# EAGLE design Seeeduino v3.0 (EAGLE 6.4)
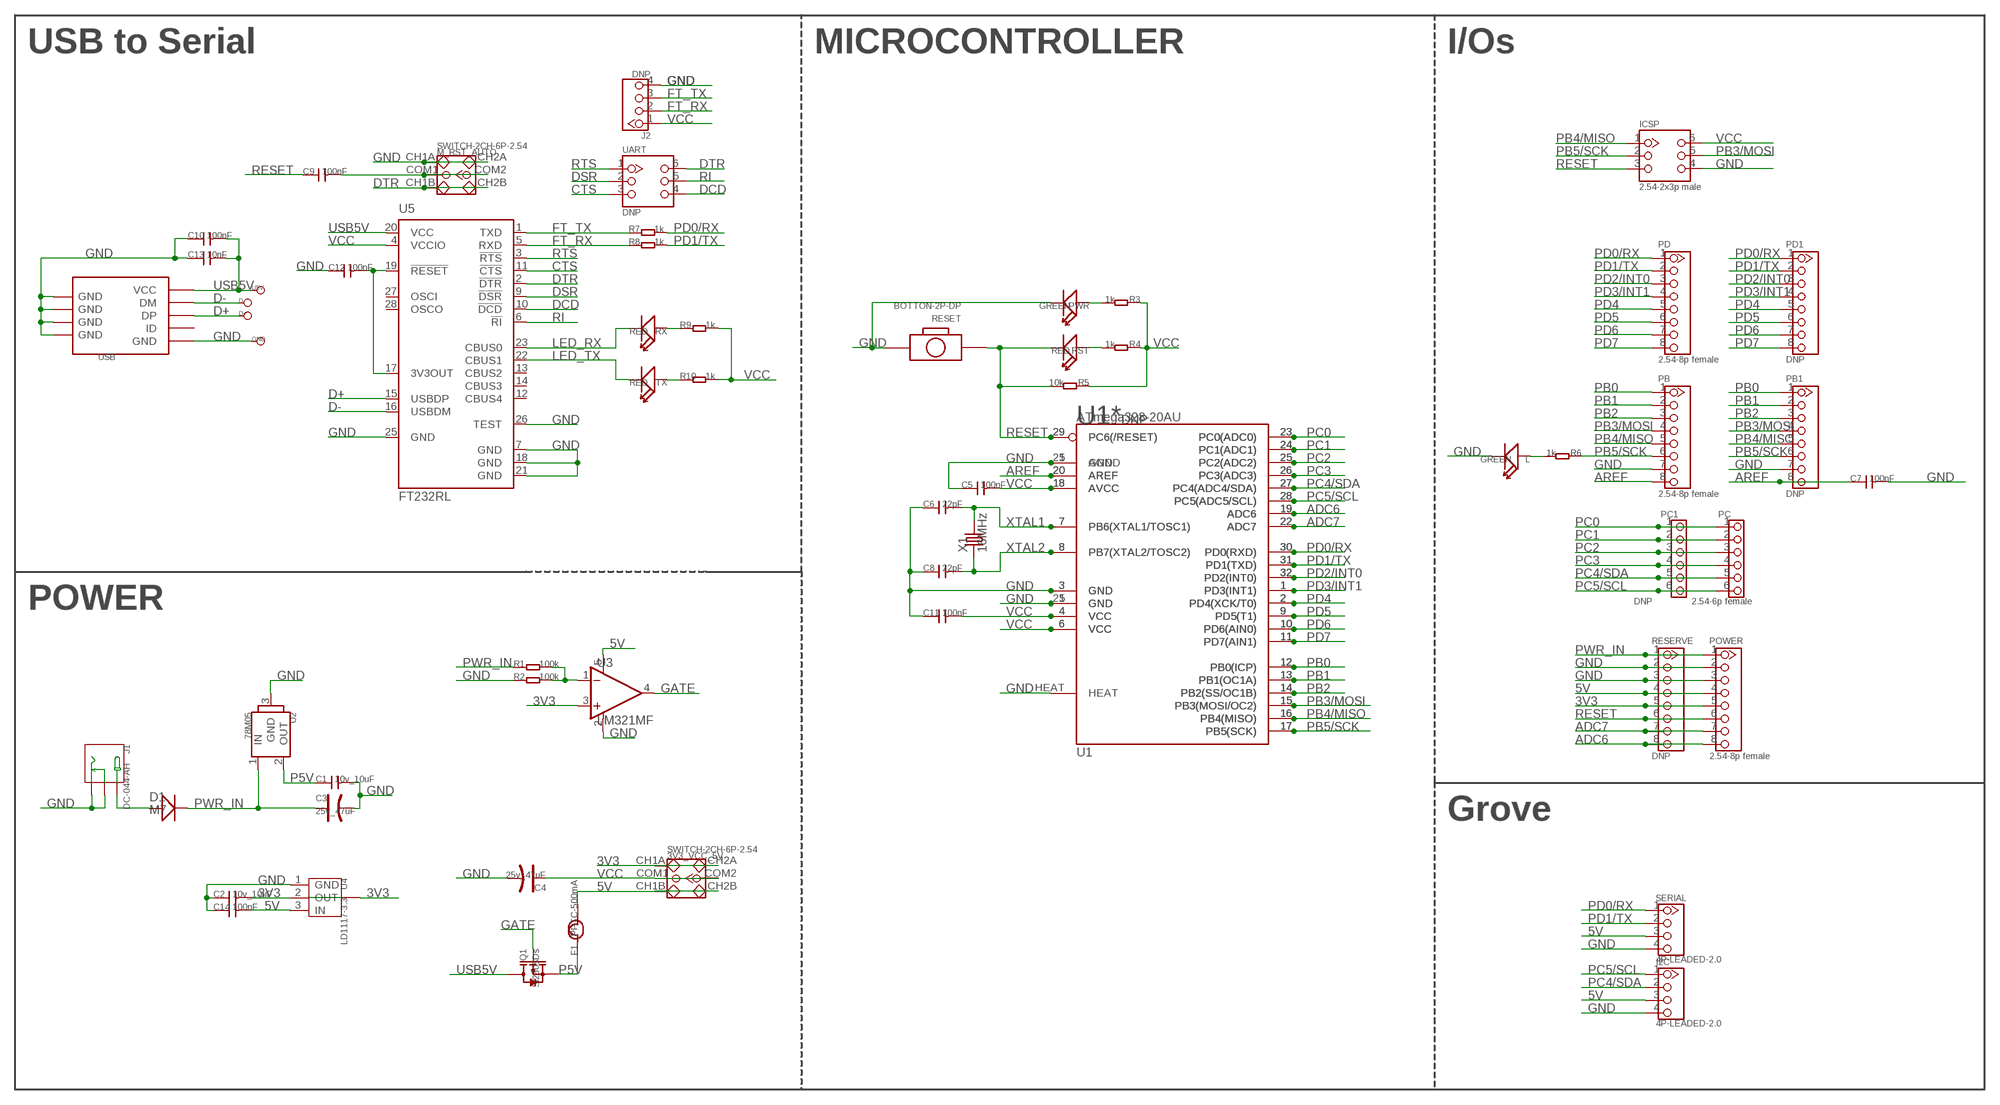
[diagram p0: schematic, sheet 1]

## Parts
3V3_VCC_5V  SWITCH-2CH-6P-2.54  SWITCH-2CH-6P  [6P-2CH-2.54-7.6X3.0]
C1  10v_10uF  C-0805  [0805]
C2  10v_10uF  C-0805  [0805]
C3  25v_47uF  CAP-ELECTRO-C  [ELECTRO-SMD-C-6MM]
C4  25v_47uF  CAP-ELECTRO-C  [ELECTRO-SMD-C-6MM]
C5  100nF  C-0603  [0603]
C6  22pF  C-0603  [0603]
C7  100nF  C-0603  [0603]
C8  22pF  C-0603  [0603]
C9  100nF  C-0603  [0603]
C10  100nF  C-0603  [0603]
C11  100nF  C-0603  [0603]
C12  100nF  C-0603  [0603]
C13  10nF  C-0603  [0603]
C14  100nF  C-0603  [0603]
D1  M7  D-SMA  [D2010]
D+  TEST_POINT_SIZE_3030  [TP_3535]
D-  TEST_POINT_SIZE_3030  [TP_3535]
F1  PPTC-500mA  FUSE  [1206]
GND  TEST_POINT_SIZE_3030  [TP_3535]
I2C  4P-LEADED-2.0  TWIG-2.0-LEADED  [4P-LEADED-2.0]
ICSP  2.54-2x3p male  HEADER-2X3P-2.54  [2X3P-2.54]
J1  DC-044-AH  DC-044  [DC-404]
J2  DNP  CK_1X4_DD  [CK_1X4]
L  GREEN  LED'0603'  [LED-0603]
M_RST_AUTO  SWITCH-2CH-6P-2.54  SWITCH-2CH-6P  [6P-2CH-2.54-7.6X3.0]
PB  2.54-8p female  HEADER-8P-2.54  [8P-2.54]
PB1  DNP  HEADER-8P-2.54  [8P-2.54]
PC  2.54-6p female  HEADER-6P-65/35MIL  [6P-2.54-65/35MIL]
PC1  DNP  HEADER-6P-65/35MIL  [6P-2.54-65/35MIL]
PD  2.54-8p female  HEADER-8P-2.54  [8P-2.54]
PD1  DNP  HEADER-8P-2.54  [8P-2.54]
POWER  2.54-8p female  HEADER-8P-2.54  [8P-2.54]
PWR  GREEN  LED'0603'  [LED-0603]
Q1  Si2305Ds  MOSFET-P-SOT23  [SOT23]
R1  100k  R-0603  [0603]
R2  100k  R-0603  [0603]
R3  1k  R-0603  [0603]
R4  1k  R-0603  [0603]
R5  10k  R-0603  [0603]
R6  1k  R-0603  [0603]
R7  1k  R-0603  [0603]
R8  1k  R-0603  [0603]
R9  1k  R-0603  [0603]
R10  1k  R-0603  [0603]
RESERVE  DNP  HEADER-8P-2.54  [8P-2.54]
RESET  BOTTON-2P-DP  BOTTON-2P-90  [2P-7.62X3.56-90D]
RST  RED  LED'0603'  [LED-0603]
RX  RED  LED'0603'  [LED-0603]
SERIAL  4P-LEADED-2.0  TWIG-2.0-LEADED  [4P-LEADED-2.0]
TX  RED  LED'0603'  [LED-0603]
U1  ATmega328-20AU  ATMEGA168  [TQFP32]
U1*  DNP  MEGA8  [MLF32X]
U2  78M05  78M05-TO252  [TO252]
U3  LM321MF  LM321  [SOT23-5]
U4  LD1117-3.3  LD1117SOT89  [SOT89]
U5  FT232RL  [SSOP28]
U5V  TEST_POINT_SIZE_3030  [TP_3535]
UART  DNP  HEADER-2X3P-2.54  [2X3P-2.54]
USB  USB-MINIUSB-5P-STRONG  [MINI-SMD-5P]
X1  16MHz  CRYSTAL-HC49S  [HC49/S]

## Nets
3V3: 3V3_VCC_5V.CH1A 3V3_VCC_5V.CH2A C2.2 POWER.5 RESERVE.5 U3.3(IN+) U4.2(OUT) U4.4(TAB)
5V [usbvcc]: 3V3_VCC_5V.CH1B 3V3_VCC_5V.CH2B C14.2 F1.2 I2C.3 POWER.4 RESERVE.4 SERIAL.3 U3.5(V+) U4.3(IN)
ADC6: POWER.8 RESERVE.8 U1*.19(ADC6) U1.19(ADC6)
ADC7: POWER.7 RESERVE.7 U1*.22(ADC7) U1.22(ADC7)
AREF: C7.1 PB1.8 PB.8 U1*.20(AREF) U1.20(AREF)
CTS: U5.11(!CTS) UART.3
D+: D+.T U5.15(USBDP) USB.3(DP)
D-: D-.T U5.16(USBDM) USB.2(DM)
DCD: U5.10(!DCD) UART.4
DSR: U5.9(!DSR) UART.2
DTR: M_RST_AUTO.CH1B M_RST_AUTO.CH2B U5.2(!DTR) UART.6
FT_RX: J2.2 R8.1 U5.5(RXD)
FT_TX: J2.3 R7.1 U5.1(TXD)
GATE: Q1.1(G) U3.4(OUT)
GND: C1.2 C2.1 C3.- C4.- C5.1 C6.1 C7.2 C8.1 C10.1 C11.1 C12.1 C13.1 C14.1 GND.T I2C.4 ICSP.4 J1.- J1.CDN J2.4 L.- M_RST_AUTO.CH1A M_RST_AUTO.CH2A PB1.7 PB.7 POWER.2 POWER.3 PWR.- R2.1 RESERVE.2 RESERVE.3 RESET.P$2 SERIAL.4 U1*.3(GND) U1*.5(GND) U1*.21(AGND) U1*.HEAT U1.3(GND) U1.5(GND) U1.21(GND) U2.3(GND) U3.2(V-) U4.1(GND) U5.7(GND) U5.18(GND) U5.21(GND) U5.25(GND) U5.26(TEST) USB.5(GND) USB.GND@1(GND) USB.GND@2(GND) USB.GND@3(GND) USB.GND@4(GND)
LED_RX: RX.- U5.23(CBUS0)
LED_TX: TX.- U5.22(CBUS1)
N$1: D1.+ J1.+
N$3: L.+ R6.2
N$6: C12.2 U5.17(3V3OUT) U5.19(!RESET)
N$7: PWR.+ R3.2
N$14: R1.2 R2.2 U3.1(IN-)
N$17: R4.2 RST.+
N$18: C9.2 M_RST_AUTO.COM1 M_RST_AUTO.COM2
N$31: R9.1 RX.+
N$32: R10.1 TX.+
P5V: C1.1 F1.1 Q1.2(S) U2.2(OUT)
PB0: PB1.1 PB.1 U1*.12(PB0(ICP)) U1.12(PB0(ICP))
PB1: PB1.2 PB.2 U1*.13(PB1(OC1A)) U1.13(PB1(OC1A))
PB2: PB1.3 PB.3 U1*.14(PB2(SS/OC1B)) U1.14(PB2(SS/OC1B))
PB3/MOSI: ICSP.5 PB1.4 PB.4 U1*.15(PB3(MOSI/OC2)) U1.15(PB3(MOSI/OC2))
PB4/MISO: ICSP.1 PB1.5 PB.5 U1*.16(PB4(MISO)) U1.16(PB4(MISO))
PB5/SCK: ICSP.2 PB1.6 PB.6 R6.1 U1*.17(PB5(SCK)) U1.17(PB5(SCK))
PC0: PC1.1 PC.1 U1*.23(PC0(ADC0)) U1.23(PC0(ADC0))
PC1: PC1.2 PC.2 U1*.24(PC1(ADC1)) U1.24(PC1(ADC1))
PC2: PC1.3 PC.3 U1*.25(PC2(ADC2)) U1.25(PC2(ADC2))
PC3: PC1.4 PC.4 U1*.26(PC3(ADC3)) U1.26(PC3(ADC3))
PC4/SDA: I2C.2 PC1.5 PC.5 U1*.27(PC4(ADC4/SDA)) U1.27(PC4(ADC4/SDA))
PC5/SCL: I2C.1 PC1.6 PC.6 U1*.28(PC5(ADC5/SCL)) U1.28(PC5(ADC5/SCL))
PD0/RX: PD1.1 PD.1 R7.2 SERIAL.1 U1*.30(PD0(RXD)) U1.30(PD0(RXD))
PD1/TX: PD1.2 PD.2 R8.2 SERIAL.2 U1*.31(PD1(TXD)) U1.31(PD1(TXD))
PD2/INT0: PD1.3 PD.3 U1*.32(PD2(INT0)) U1.32(PD2(INT0))
PD3/INT1: PD1.4 PD.4 U1*.1(PD3(INT1)) U1.1(PD3(INT1))
PD4: PD1.5 PD.5 U1*.2(PD4(XCK/T0)) U1.2(PD4(XCK/T0))
PD5: PD1.6 PD.6 U1*.9(PD5(T1)) U1.9(PD5(T1))
PD6: PD1.7 PD.7 U1*.10(PD6(AIN0)) U1.10(PD6(AIN0))
PD7: PD1.8 PD.8 U1*.11(PD7(AIN1)) U1.11(PD7(AIN1))
PWR_IN: C3.+ D1.- POWER.1 R1.1 RESERVE.1 U2.1(IN)
RESET: C9.1 ICSP.3 POWER.6 R5.2 RESERVE.6 RESET.P$1 RST.- U1*.29(PC6(/RESET)) U1.29(PC6(/RESET))
RI: U5.6(!RI) UART.5
RTS: U5.3(!RTS) UART.1
USB5V: C10.2 C13.2 Q1.3(D) U5.20(VCC) U5V.T USB.1(VCC)
VCC: 3V3_VCC_5V.COM1 3V3_VCC_5V.COM2 C4.+ C5.2 C11.2 ICSP.6 J2.1 R3.1 R4.1 R5.1 R9.2 R10.2 U1*.4(VCC) U1*.6(VCC) U1*.18(AVCC) U1.4(VCC) U1.6(VCC) U1.18(AVCC) U5.4(VCCIO)
XTAL1: C6.2 U1*.7(PB6(XTAL1/TOSC1)) U1.7(PB6(XTAL1/TOSC1)) X1.2
XTAL2: C8.2 U1*.8(PB7(XTAL2/TOSC2)) U1.8(PB7(XTAL2/TOSC2)) X1.1
Unconnected: U5.12(CBUS4) U5.13(CBUS2) U5.14(CBUS3) U5.27(OSCI) U5.28(OSCO) USB.4(ID)

## Notes on the sheet
- USB to Serial | MICROCONTROLLER | I/Os
- POWER
- Grove

## Library data of the parts
3V3_VCC_5V M_RST_AUTO = Discrete:SWITCH-2CH-6P
C1 C2 C5-C14 = Discrete:C*: Ceramic Capacitors
C3 C4 = Discrete:CAP*: Electrolytic Capacitors,Tantalum Capacitors and Super Capacitors
D1 = Discrete:D*
D+ D- GND U5V = For_Test_Albert:TEST_POINT
F1 = Discrete:FUSE
I2C SERIAL = Connector:TWIG-2.0-LEADED
ICSP UART = Connector:HEADER-2X3P
J1 = For_Test_Albert:DC-044
J2 = CONNECTER:CK_1X4
L PWR RST RX TX = Discrete:LED*
PB PB1 PD PD1 POWER RESERVE = Connector:HEADER-8P
PC PC1 = Connector:HEADER-6P
Q1 = Discrete:MOSFET-P: Si2305DS Si2323CDS
R1-R10 = Discrete:R*
RESET = Discrete:BOTTON-2P
U1 = IC:ATMEGA168
U1* = ICs_v54:MEGA8
U2 = IC:78M05: http://search.digikey.com/scripts/DkSearch/dksus.dll?Detail&name=MC78M05CDTXTR-ND
U3 = IC:LM321: http://www.national.com/ds/LM/LM321.pdf
U4 = IC:LD1117
U5 = IC_SMD:FT232R: Source: http://www.ftdichip.com/Documents/DataSheets/DS_FT232R_v104.pdf
USB = Connector:USB-MINIUSB-5P
X1 = Discrete:CRYSTAL*: CRYSTAL

## Net classes
0 default: width 0.203 mm, drill 0.305 mm, clearance 0.152 mm
1 power: width 0.203 mm, drill 0.305 mm, clearance 0.203 mm
2 gnd: width 0.203 mm, drill 0.305 mm, clearance 0.203 mm
3 usbvcc: width 0.203 mm, drill 0.305 mm, clearance 0.203 mm

## Board
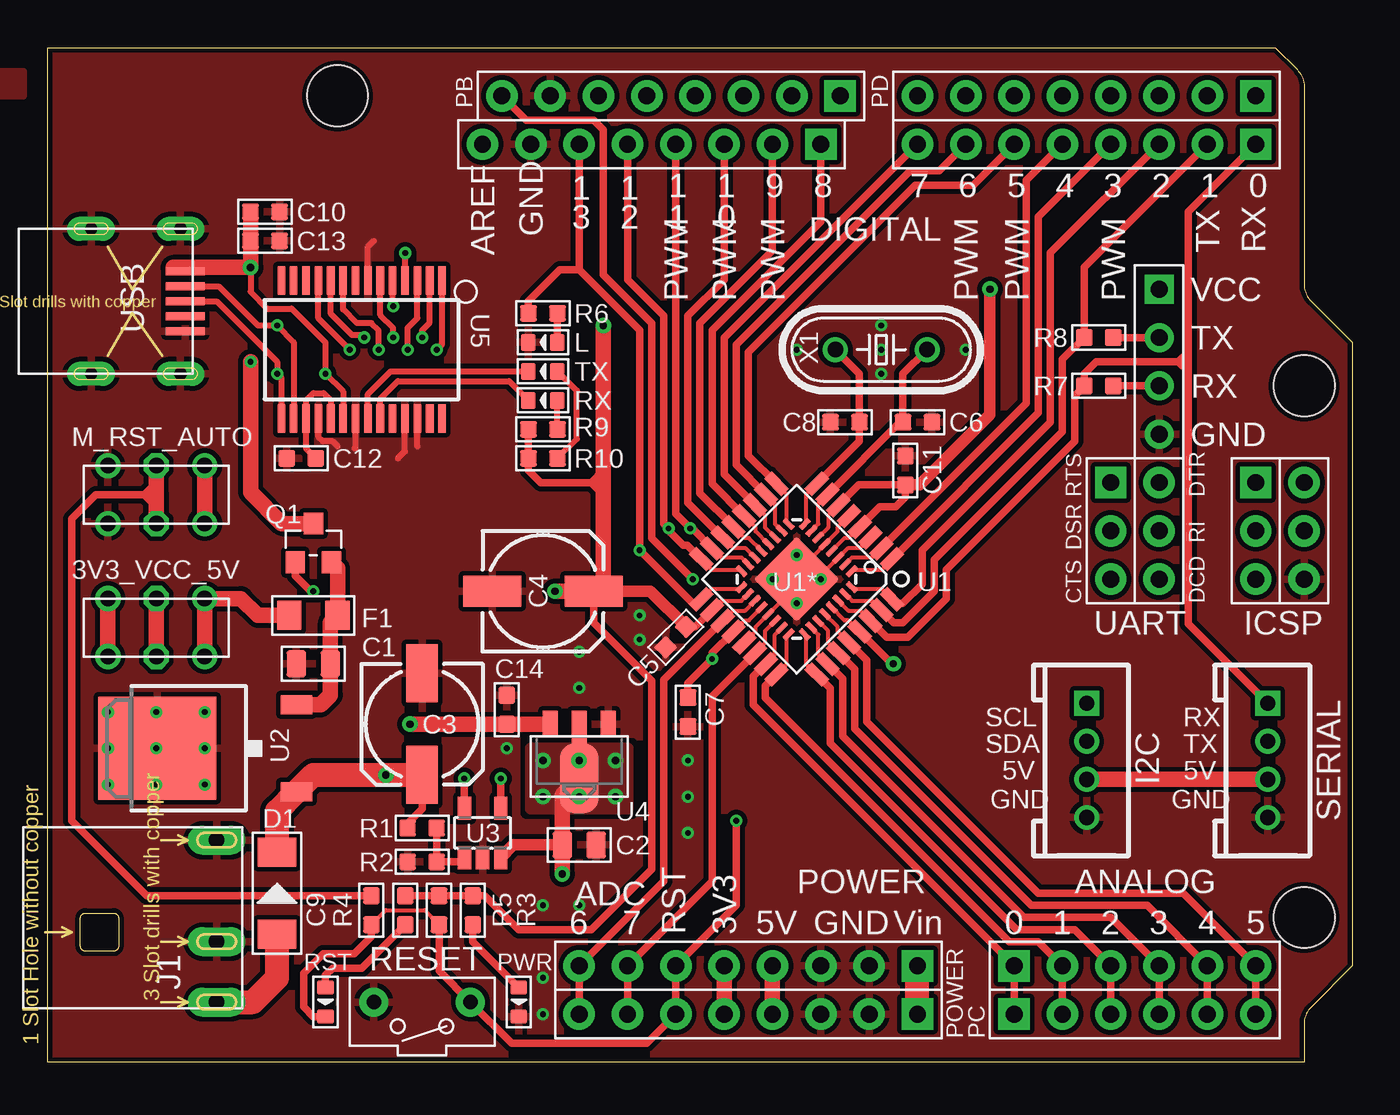
[diagram p1: board, top side]
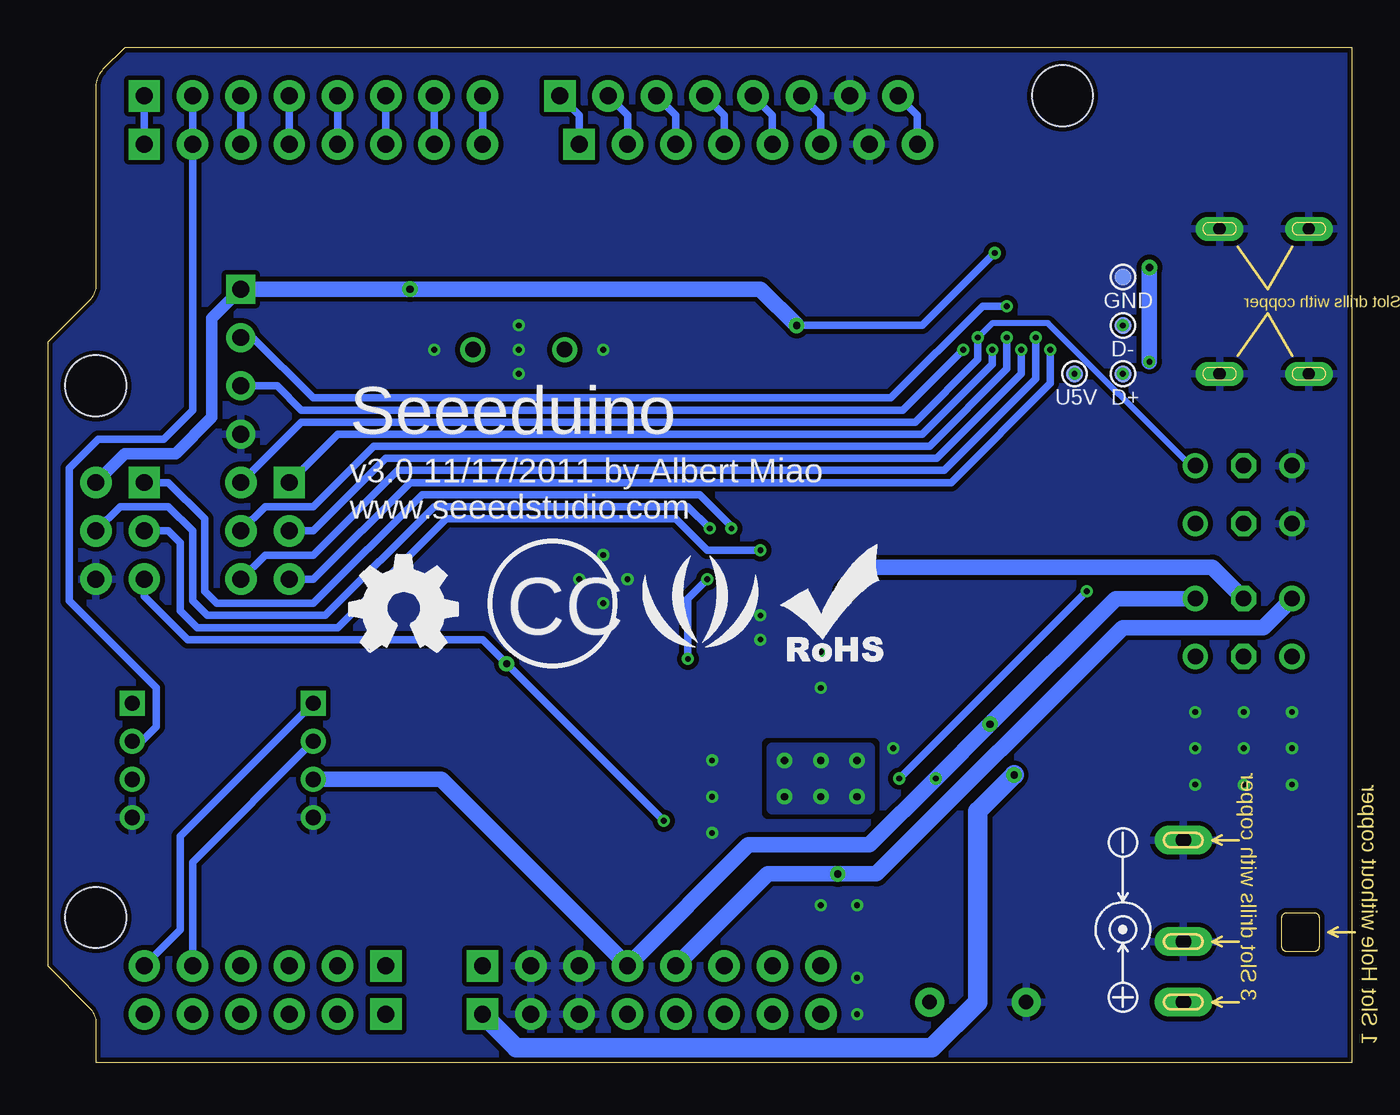
[diagram p2: board, bottom side, seen from below]

Size 68.58 x 53.34 mm. Coordinates in mm from the lower left corner, seen from the top.
Outline: 0,0 0,53.34 64.52,53.34 65.67,52.19 arc-45 66.04,51.29 66.04,40.91 arc45 66.41,40.01 68.58,37.85 68.58,5.08 66.41,2.91 arc45 66.04,2.01 66.04,0 0,0
Copper layers (1*16): Top 0.035mm / dielectric 1.5mm / Bottom 0.035mm
Design rules "rule_manufacture_limit": minimum track width 8mil, minimum drill 12mil, track to track 6mil, track to pad 6mil, pad to pad 6mil, via to via 10mil, smd to smd 0mil, copper to edge 10mil, drill to drill 10mil, minimum pad ring 10mil, minimum via ring 6mil, stop-mask expansion 2mil, vias tented up to drill 25mil, thermal gap 10mil
Holes 3.2 mm at 15.24,50.8 66.04,7.62 66.04,35.56
tRestrict: area 19.1,33.8 to 19.2,33.9

### Footprints (pad centres in the part's own frame; a part is rotated, then mirrored left to right if it is on the bottom)
6P-2CH-2.54-7.6X3.0 = drill 0.813 pad 1.27 round: CH1A -1.524,2.54; CH1B -1.524,-2.54; CH2A 1.524,2.54; CH2B 1.524,-2.54 | drill 0.813 pad 1.27 octagon: COM1 -1.524,0; COM2 1.524,0
0805 = smd 1.016 x 1.397: 1 -0.889,0; 2 0.889,0
ELECTRO-SMD-C-6MM = smd 3.048 x 1.651: + 2.667,0; - -2.667,0
0603 = smd 0.889 x 0.889: 1 -0.762,0; 2 0.762,0
D2010 = smd 1.524 x 2.032: + -2.159,0; - 2.159,0
TP_3535 = smd 0.889 x 0.889: T 0,0
1206 = smd 1.27 x 1.524: 1 -1.27,0; 2 1.27,0
4P-LEADED-2.0 = drill 0.8 pad 1.27 square: 1 -3,0 | drill 0.8 pad 1.27 round: 2 -1,0; 3 1,0; 4 3,0
2X3P-2.54 = drill 0.889 pad 1.651 square: 1 -1.27,2.54 | drill 0.889 pad 1.651 round: 2 -1.27,0; 3 -1.27,-2.54; 4 1.27,-2.54; 5 1.27,0; 6 1.27,2.54
DC-404 = drill 0.813 pad 1.524 long: + 3.175,10.16; - -5.334,10.16; CDN 0,10.16
CK_1X4 = drill 0.889 pad 1.524 square: 1 0,3.81 | drill 0.889 pad 1.524 round: 2 0,1.27; 3 0,-1.27; 4 0,-3.81
LED-0603 = smd 0.762 x 0.889: + -0.762,0; - 0.762,0
8P-2.54 = drill 0.889 pad 1.651 square: 1 0,8.89 | drill 0.889 pad 1.651 round: 2 0,6.35; 3 0,3.81; 4 0,1.27; 5 0,-1.27; 6 0,-3.81; 7 0,-6.35; 8 0,-8.89
6P-2.54-65/35MIL = drill 0.889 pad 1.651 square: 1 0,6.35 | drill 0.889 pad 1.651 round: 2 0,3.81; 3 0,1.27; 4 0,-1.27; 5 0,-3.81; 6 0,-6.35
SOT23 = smd 1.016 x 1.143: 1 -0.95,-1.016; 2 0.95,-1.016; 3 0,1.016
2P-7.62X3.56-90D = drill 0.762 pad 1.524 round: P$1 0,2.54; P$2 0,-2.54
TQFP32 = smd 1.27 x 0.559: 1 -4.293,2.8; 2 -4.293,2; 3 -4.293,1.2; 4 -4.293,0.4; 5 -4.293,-0.4; 6 -4.293,-1.2; 7 -4.293,-2; 8 -4.293,-2.8; 17 4.293,-2.8; 18 4.293,-2; 19 4.293,-1.2; 20 4.293,-0.4; 21 4.293,0.4; 22 4.293,1.2; 23 4.293,2; 24 4.293,2.8 | smd 0.559 x 1.27: 9 -2.8,-4.293; 10 -2,-4.293; 11 -1.2,-4.293; 12 -0.4,-4.293; 13 0.4,-4.293; 14 1.2,-4.293; 15 2,-4.293; 16 2.8,-4.293; 25 2.8,4.293; 26 2,4.293; 27 1.2,4.293; 28 0.4,4.293; 29 -0.4,4.293; 30 -1.2,4.293; 31 -2,4.293; 32 -2.8,4.293
MLF32X = smd 0.7 x 0.3: 1 -2.35,1.75; 2 -2.35,1.25; 3 -2.35,0.75; 4 -2.35,0.25; 5 -2.35,-0.25; 6 -2.35,-0.75; 7 -2.35,-1.25; 8 -2.35,-1.75; 17 2.35,-1.75; 18 2.35,-1.25; 19 2.35,-0.75; 20 2.35,-0.25; 21 2.35,0.25; 22 2.35,0.75; 23 2.35,1.25; 24 2.35,1.75 | smd 0.3 x 0.7: 9 -1.75,-2.35; 10 -1.25,-2.35; 11 -0.75,-2.35; 12 -0.25,-2.35; 13 0.25,-2.35; 14 0.75,-2.35; 15 1.25,-2.35; 16 1.75,-2.35; 25 1.75,2.35; 26 1.25,2.35; 27 0.75,2.35; 28 0.25,2.35; 29 -0.25,2.35; 30 -0.75,2.35; 31 -1.25,2.35; 32 -1.75,2.35 | smd 3.175 x 3.175: HEAT 0,0
TO252 = smd 1.016 x 1.651: 1 -2.286,-4.826; 2 2.286,-4.826 | smd 5.4 x 6.2: 3 0,2.5
SOT23-5 = smd 0.69 x 1.2: 1 -0.95,-1.3; 2 0,-1.3; 3 0.95,-1.3; 4 0.95,1.3; 5 -0.95,1.3
SOT89 = smd 0.8 x 1.4: 1 -1.524,-1.905; 3 1.524,-1.905 | smd 0.8 x 1.9: 2 0,-1.651 | smd 2.032 x 3.65: 4 0,0.94
SSOP28 = smd 0.4 x 1.5: 1 -4.225,-3.625; 2 -3.575,-3.625; 3 -2.925,-3.625; 4 -2.275,-3.625; 5 -1.625,-3.625; 6 -0.975,-3.625; 7 -0.325,-3.625; 8 0.325,-3.625; 9 0.975,-3.625; 10 1.625,-3.625; 11 2.275,-3.625; 12 2.925,-3.625; 13 3.575,-3.625; 14 4.225,-3.625; 15 4.225,3.625; 16 3.575,3.625; 17 2.925,3.625; 18 2.275,3.625; 19 1.625,3.625; 20 0.975,3.625; 21 0.325,3.625; 22 -0.325,3.625; 23 -0.975,3.625; 24 -1.625,3.625; 25 -2.275,3.625; 26 -2.925,3.625; 27 -3.575,3.625; 28 -4.225,3.625
MINI-SMD-5P = smd 2.032 x 0.406: 1 0.381,-1.575; 2 0.381,-0.787; 3 0.381,0; 4 0.381,0.787; 5 0.381,1.575 | drill 0.635 pad 1.27 long: GND@1 0.635,3.81; GND@2 5.334,3.81; GND@3 5.334,-3.81; GND@4 0.635,-3.81
HC49/S = drill 0.813 round: 1 -2.413,0; 2 2.413,0

### Placement (x,y rotation side)
3V3_VCC_5V  5.71,22.86 90 top
C1  13.97,20.95 180 top
C2  27.94,11.43 180 top
C3  19.68,17.78 270 top
C4  26.04,24.77 0 top
C5  33.02,22.35 45 top
C6  45.72,33.66 180 top
C7  33.66,18.41 270 top
C8  41.91,33.66 0 top
C9  17.02,8 90 top
C10  11.43,44.7 180 top
C11  45.09,31.11 270 top
C12  13.34,31.75 0 top
C13  11.43,43.18 180 top
C14  24.13,18.54 270 top
D1  12.06,8.89 90 top
D+  12.06,36.2 0 bottom
D-  12.06,38.73 0 bottom
F1  13.97,23.5 180 top
GND  12.06,41.27 0 bottom
I2C  54.61,15.88 270 top
ICSP  64.77,27.94 0 top
J1  -1.27,6.35 270 top
J2  58.42,36.83 0 top
L  26.04,37.85 180 top
M_RST_AUTO  5.71,29.84 90 top
PB  32.77,50.8 270 top
PB1  31.75,48.26 270 top
PC  57.15,2.54 90 top
PC1  57.15,5.08 90 top
PD  54.61,50.8 270 top
PD1  54.61,48.26 270 top
POWER  36.83,2.54 270 top
PWR  24.77,3.17 270 top
Q1  13.97,27.3 0 top
R1  19.68,12.32 0 top
R2  19.68,10.54 0 top
R3  22.35,8 270 top
R4  18.8,8 270 top
R5  20.57,8 270 top
R6  26.04,39.37 0 top
R7  55.24,35.56 180 top
R8  55.24,38.1 180 top
R9  26.04,33.27 180 top
R10  26.04,31.75 180 top
RESERVE  36.83,5.08 270 top
RESET  19.68,3.17 270 top
RST  14.61,3.17 270 top
RX  26.04,34.8 180 top
SERIAL  64.14,15.88 270 top
TX  26.04,36.32 180 top
U1  39.37,25.4 225 top
U1*  39.37,25.4 225 top
U2  8.26,16.51 90 top
U3  22.86,12.06 0 top
U4  27.94,15.88 180 top
U5  16.51,37.47 180 top
U5V  14.61,36.2 0 bottom
U$2  [ROHS_SILK]  27.94,23.5 0 bottom
U$3  [SEEED_MASK]  4.45,48.9 0 top
U$4  [LOGO_SILK]  34.29,23.5 0 bottom
U$5  [OSHW_FILLX200_NOTEXT]  52.7,21.59 0 bottom
UART  57.15,27.94 0 top
USB  7.62,40.01 180 top
X1  43.81,37.47 0 top

### Tracks (layer width: path | path; a pad name or v marks a point on that pad's centre or on a via)
3V3  (via drill 0.38 pad 0.81)
  Top 0.61: C2.2 24.48,11.43 U3.3
  Top 0.813: RESERVE.5 POWER.5 | 3V3_VCC_5V.CH1A 3V3_VCC_5V.CH2A | U4.4 27.05,14.05 C2.2 v27.05,9.91 | U4.2 v27.94,15.88
  Bottom 0.813: RESERVE.5 30.73,9.91 v27.05,9.91 25.02,9.91 12.06,22.86 4.7,22.86 3V3_VCC_5V.CH2A
  other vias: 26.04,15.88 26.04,13.97 27.94,13.97 29.84,13.97 29.84,15.88
  pour Top (isolate 0.254, no thermals): 25.4,16.51 30.48,16.51 30.48,13.34 25.4,13.34
  pour Bottom (isolate 0.254, no thermals): 30.48,16.51 25.4,16.51 25.4,13.34 30.48,13.34
5V  (via drill 0.3 pad 0.64, 0.38 pad 0.81)
  Top 0.406: U3.5 v21.91,14.92
  Top 0.813: RESERVE.4 POWER.4 | 3V3_VCC_5V.CH1B 3V3_VCC_5V.CH2B 10.16,24.38 11.05,23.5 F1.2 | v19.05,17.78 C14.2 U4.3 | I2C.3 SERIAL.3
  Bottom 0.813: 3V3_VCC_5V.CH2B 12.45,24.38 v19.05,17.78 v21.91,14.92 25.4,11.43 31.75,11.43 RESERVE.4 47.9,14.88 I2C.3
ADC6
  Top 0.203: U1*.19 36.66,23.75 36.02,23.75 U1.19
  Top 0.406: POWER.8 RESERVE.8 32.38,9.53 32.38,20.11 U1.19
ADC7
  Top 0.203: U1*.22 37.72,22.69 37.72,22.05 U1.22
  Top 0.406: POWER.7 RESERVE.7 34.92,9.53 34.92,19.26 U1.22
AREF  (via drill 0.3 pad 0.64)
  Top 0.203: U1*.20 36.86,23.24 36.65,23.24 U1.20
  Top 0.406: U1.20 34.92,21.52 v34.92,21.21 33.66,19.94 C7.1 | PB.8 25.15,49.53 28.7,49.53 29.21,49.02 29.21,41.4 31.75,38.86 31.75,27.56 v33.91,25.4
  Bottom 0.406: PB1.8 22.86,49.78 PB.8 | v34.92,21.21 34.92,24.38 v33.91,25.4
CTS  (via drill 0.3 pad 0.64)
  Top 0.305: U5.11 14.23,39.1 v15.88,37.47
  Bottom 0.406: UART.3 54.61,25.4 49.53,30.48 21.08,30.48 15.88,35.69 v15.88,37.47
D+  (via drill 0.3 pad 0.64)
  Top 0.305: U5.15 12.29,35.98 D+.T 12.06,36.83 8.89,40.01 USB.3
  other vias: 12.06,36.2
D-  (via drill 0.3 pad 0.64)
  Top 0.305: U5.16 12.94,37.87 D-.T 11.05,38.73 8.99,40.79 USB.2
  other vias: 12.06,38.73
DCD  (via drill 0.3 pad 0.64)
  Top 0.305: U5.10 14.88,39.34 16,38.23 16.51,38.23 v16.64,38.1
  Bottom 0.406: UART.4 57.15,26.67 54.61,26.67 50.16,31.11 21.46,31.11 16.64,35.94 v16.64,38.1
DSR  (via drill 0.3 pad 0.64)
  Top 0.305: U5.9 15.54,39.58 16.26,38.86 17.02,38.86 17.4,38.48 v17.4,37.47
  Bottom 0.406: UART.2 54.61,27.94 50.8,31.75 21.84,31.75 17.4,36.2 v17.4,37.47
DTR  (via drill 0.3 pad 0.64)
  Top 0.305: U5.2 20.09,38.88 19.68,38.48 v19.68,38.1
  Top 0.813: M_RST_AUTO.CH1B M_RST_AUTO.CH2B
  Bottom 0.305: v19.68,38.1 18.92,38.86 16,38.86 8.51,31.37 M_RST_AUTO.CH2B
  Bottom 0.406: UART.6 55.24,33.66 22.99,33.66 19.68,36.96 v19.68,38.1
FT_RX  (via drill 0.3 pad 0.64)
  Top 0.305: U5.5 18.14,39.78 v18.16,39.75
  Top 0.406: J2.2 R8.1
  Bottom 0.406: J2.2 57.78,38.1 54.61,34.92 24.26,34.92 19.43,39.75 v18.16,39.75
FT_TX  (via drill 0.3 pad 0.64)
  Top 0.305: U5.1 20.73,37.75 v20.45,37.47
  Top 0.406: J2.3 R7.1
  Bottom 0.406: J2.3 56.52,35.56 55.24,34.29 23.62,34.29 v20.45,37.47
GATE  (via drill 0.3 pad 0.64)
  Top 0.406: U3.4 v23.81,14.92 | Q1.1 13.02,25.59 13.84,24.77 v13.97,24.77
  Bottom 0.406: v23.81,14.92 v13.97,24.77
GND  (via drill 0.3 pad 0.64)
  Top 0.203: v40.64,25.4 40.64,25.61 U1*.3 42.08,27.05 42.72,27.05 U1.3 | v39.37,26.67 40.29,26.67 U1*.5 41.53,27.91 41.53,28.12 U1.5 | U1.21 37.21,22.68 37.21,22.89 U1*.21 38.45,24.13 v39.37,24.13 U1*.HEAT
  Top 0.305: U5.7 16.84,42.87 17.14,43.18 | U5.25 18.79,32.12 18.41,31.75 | U5.26 19.43,32.39 19.43,32.38 | U5.21 16.18,32.31 16.13,32.26 | U5.18 14.23,32.88 14.48,32.64 14.99,32.64 15.24,32.38
  other vias: 8.26,16.51 8.26,18.41 8.26,14.61 5.71,14.61 3.17,14.61 3.17,16.51 3.17,18.41 5.71,18.41 5.71,16.51 38.1,25.4 31.11,23.5 31.11,22.23 33.66,15.88 33.66,13.97 33.66,12.06 27.94,19.68 27.94,21.59 24.13,16.51 26.04,2.54 26.04,4.45 43.81,36.2 43.81,37.47 43.81,38.73 39.37,37.47 48.26,37.47 26.04,8.26 27.94,8.26
  pour Top: -2.54,52.07 -1.27,52.07 -1.27,50.8 -2.54,50.8
  pour Top (isolate 0.254, rank 6): 0,53.34 68.58,53.34 68.58,0 0,0
  pour Bottom (isolate 0.254, rank 6): 0,53.34 68.58,53.34 68.58,0 0,0
LED_RX
  Top 0.305: RX.- 24.26,35.81 18.41,35.81 17.48,34.88 U5.23
LED_TX
  Top 0.305: TX.- 18.03,36.32 16.84,35.12 U5.22
N$1
  Top 1.27: J1.+ 10.79,3.17 12.06,4.45 D1.+
N$3
  Top 0.406: L.+ R6.2
N$6
  Top 0.305: U5.19 14.88,34.8 14.5,35.18 13.97,35.18 13.59,34.8 U5.17 13.59,32.26 C12.2
N$7
  Top 0.406: R3.2 22.35,6.35 PWR.+
N$14
  Top 0.406: R1.2 R2.2 21.69,10.54 U3.1
N$17
  Top 0.406: R4.2 16.51,4.95 14.99,4.95 14.61,4.57 RST.+
N$18
  Top 0.406: 5.08,29.84 2.54,29.84 1.27,28.57 1.27,12.7 5.21,8.76 C9.2 | 5.08,29.84 5.71,29.21 5.71,29.84 | 5.08,29.84 5.71,29.84 | 5.08,29.84 5.71,30.48 5.71,29.84
  Top 0.813: M_RST_AUTO.COM1 5.71,29.84 M_RST_AUTO.COM2
N$31
  Top 0.305: R9.1 RX.+
N$32
  Top 0.305: TX.+ 27.81,35.31 27.81,32.77 R10.1
P5V
  Top 0.813: U2.2 14.35,18.8 14.86,19.3 C1.1 14.86,23.11 F1.1 15.24,25.97 Q1.2
PB0
  Top 0.203: U1*.12 37.21,27.91 37.21,28.12 U1.12
  Top 0.406: U1.12 34.92,30.41 34.92,38.48 40.64,44.2 PB1.1
  Bottom 0.406: PB1.1 40.64,49.78 PB.1
PB1
  Top 0.203: U1*.13 36.86,27.56 36.65,27.56 U1.13
  Top 0.406: U1.13 34.29,29.91 34.29,38.86 38.1,42.67 PB1.2
  Bottom 0.406: PB1.2 38.1,49.78 PB.2
PB2
  Top 0.203: U1*.14 36.66,27.05 36.02,27.05 U1.14
  Top 0.406: U1.14 33.66,29.42 33.66,39.24 35.56,41.15 PB1.3
  Bottom 0.406: PB1.3 35.56,49.78 PB.3
PB3/MOSI  (via drill 0.3 pad 0.64)
  Top 0.203: U1*.15 36.46,26.54 35.4,26.54 U1.15
  Top 0.406: PB1.4 33.02,28.83 v33.78,28.07 33.87,28.07 U1.15
  Bottom 0.406: PB1.4 33.02,49.78 PB.4 | ICSP.5 64.77,29.21 62.23,29.21 60.96,27.94 60.96,24.26 60.2,23.5 53.98,23.5 48.26,29.21 34.92,29.21 v33.78,28.07
PB4/MISO  (via drill 0.3 pad 0.64)
  Top 0.203: U1*.16 36.39,25.91 34.9,25.91 U1.16
  Top 0.406: PB1.5 30.48,41.15 32.38,39.24 32.38,28.32 v32.64,28.07 32.64,27.94 33.4,27.18 33.63,27.18 U1.16
  Bottom 0.406: PB1.5 30.48,49.78 PB.5 | ICSP.1 62.23,30.48 60.33,28.57 60.33,24.77 59.69,24.13 54.61,24.13 48.9,29.84 34.29,29.84 32.64,28.19 v32.64,28.07
PB5/SCK  (via drill 0.3 pad 0.64)
  Top 0.203: U1*.17 36.39,24.89 34.9,24.89 U1.17
  Top 0.406: 27.94,41.66 PB1.6 | 27.94,41.66 31.11,38.48 v31.11,26.92 33.91,24.13 34.14,24.13 U1.17 | 27.94,41.66 26.92,41.66 25.27,40.01 R6.1
  Bottom 0.406: PB1.6 27.94,49.78 PB.6 | ICSP.2 62.23,27.94 61.59,27.3 61.59,23.75 60.71,22.86 53.34,22.86 47.62,28.57 35.56,28.57 33.91,26.92 v31.11,26.92
PC0
  Top 0.203: U1*.23 38.23,22.49 38.23,21.43 U1.23
  Top 0.406: U1.23 37.08,20.29 37.08,18.8 PC1.1 PC.1
PC1
  Top 0.203: U1*.24 38.86,22.42 38.86,20.93 U1.24
  Top 0.406: U1.24 37.72,19.79 37.72,19.18 50.55,6.35 52.07,6.35 PC1.2 PC.2
PC2
  Top 0.203: U1*.25 39.88,22.42 39.88,20.93 U1.25
  Top 0.406: U1.25 41.15,19.66 41.15,16.76 50.93,6.99 53.98,6.99 PC1.3 PC.3
PC3
  Top 0.203: U1*.26 40.51,22.49 40.51,21.43 U1.26
  Top 0.406: U1.26 41.78,20.16 41.78,17.14 51.31,7.62 55.88,7.62 PC1.4 PC.4
PC4/SDA
  Top 0.203: U1*.27 41.02,22.69 41.02,22.05 U1.27
  Top 0.406: U1.27 42.42,20.66 42.42,17.53 51.69,8.26 57.78,8.26 PC1.5 PC.5
  Bottom 0.406: I2C.2 60.96,10.53 PC1.5
PC5/SCL
  Top 0.203: U1*.28 41.53,22.89 41.53,22.68 U1.28
  Top 0.406: U1.28 43.05,21.15 43.05,17.91 52.07,8.89 59.69,8.89 PC1.6 PC.6
  Bottom 0.406: I2C.1 61.59,11.89 61.59,6.99 PC1.6
PD0/RX
  Top 0.203: U1*.30 42.08,23.75 42.72,23.75 U1.30
  Top 0.406: PD1.1 59.94,44.7 59.94,37.34 | U1.30 44.12,22.35 45.21,22.35 47.24,24.38 47.24,25.91 53.98,32.64 53.98,35.05 R7.2 54.48,36.2 55.12,36.83 59.44,36.83 | SERIAL.1 59.94,23.07 59.94,36.32 | 59.94,37.34 59.94,36.32 | 59.44,36.83 59.94,36.83 | 59.44,36.83 59.94,37.34 | 59.44,36.83 59.94,36.32
  Bottom 0.406: PD1.1 PD.1
PD1/TX
  Top 0.203: U1*.31 42.28,24.26 43.34,24.26 U1.31
  Top 0.406: PD1.2 54.48,41.78 R8.2 53.34,36.96 53.34,33.15 46.61,26.42 46.61,24.77 44.96,23.11 44.48,23.11 U1.31
  Bottom 0.406: PD.2 PD1.2 60.96,34.29 62.48,32.77 65.91,32.77 67.44,31.24 67.44,24.26 62.87,19.68 62.87,17.65 63.64,16.88 SERIAL.2
PD2/INT0
  Top 0.203: U1*.32 42.35,24.89 43.84,24.89 U1.32
  Top 0.406: PD1.3 52.7,42.55 52.7,33.66 45.97,26.92 45.97,25.15 44.96,24.13 44.6,24.13 U1.32
  Bottom 0.406: PD1.3 PD.3
PD3/INT1
  Top 0.203: U1*.1 42.35,25.91 43.84,25.91 U1.1
  Top 0.406: PD1.4 52.07,44.45 52.07,34.14 U1.1
  Bottom 0.406: PD1.4 PD.4
PD4
  Top 0.203: U1*.2 42.28,26.54 43.34,26.54 U1.2
  Top 0.406: PD1.5 51.44,46.35 51.44,34.64 U1.2
  Bottom 0.406: PD1.5 PD.5
PD5
  Top 0.203: U1*.9 38.86,28.38 38.86,29.87 U1.9
  Top 0.406: U1.9 36.83,31.9 36.83,37.34 45.59,46.1 48.64,46.1 PD1.6
  Bottom 0.406: PD1.6 PD.6
PD6
  Top 0.203: U1*.10 38.23,28.31 38.23,29.37 U1.10
  Top 0.406: U1.10 36.2,31.4 36.2,37.72 45.34,46.86 46.86,46.86 PD1.7
  Bottom 0.406: PD1.7 PD.7
PD7
  Top 0.203: U1*.11 37.72,28.11 37.72,28.75 U1.11
  Top 0.406: U1.11 35.56,30.91 35.56,38.1 PD1.8
  Bottom 0.406: PD1.8 PD.8
PWR_IN  (via drill 0.38 pad 0.81)
  Top 0.406: R1.1 18.92,12.57 19.68,13.34 C3.+
  Top 1.27: POWER.1 RESERVE.1 | C3.+ v17.78,15.11 13.97,15.11 U2.1 12.06,13.21 D1.-
  Bottom 1.016: v17.78,15.11 19.68,13.21 19.68,3.17 22.1,0.76 43.94,0.76 POWER.1
RESET  (via drill 0.3 pad 0.64, 0.38 pad 0.81)
  Top 0.203: C9.1 17.78,8 19.81,8 R5.2 | U1*.29 41.88,23.24 42.09,23.24 U1.29
  Top 0.406: R5.2 20.57,4.83 RESET.P$1 24.38,1.02 31.5,1.02 POWER.6 RESERVE.6 36.2,8.26 v36.2,12.7 | C9.1 17.02,6.6 16.13,5.71 14.48,5.71 13.46,4.7 13.46,2.92 13.97,2.41 RST.- | U1.29 44.38,20.95 v44.45,20.95
  Bottom 0.406: v36.2,12.7 v44.45,20.95 45.72,22.23 61.21,22.23 63.5,24.51 ICSP.3
RI  (via drill 0.3 pad 0.64)
  Top 0.305: U5.6 17.48,39.28 18.16,38.61 v18.16,38.1
  Bottom 0.406: UART.5 57.15,29.21 54.61,29.21 51.44,32.38 22.23,32.38 18.16,36.45 v18.16,38.1
RTS  (via drill 0.3 pad 0.64)
  Top 0.305: U5.3 19.43,39.12 18.92,38.61 v18.92,37.47
  Bottom 0.406: UART.1 53.34,33.02 22.61,33.02 18.92,36.7 v18.92,37.47
USB5V  (via drill 0.3 pad 0.64, 0.38 pad 0.81)
  Top 0.305: U5.20 15.54,35.27 U5V.T 14.61,37.85 12.83,39.62 11.56,39.62 10.67,40.51 v10.67,41.78
  Top 0.406: 7.24,41.78 USB.1
  Top 0.813: C10.2 C13.2 v10.67,41.78 7.24,41.78 6.6,41.78 | Q1.3 12.32,28.32 10.67,29.97 v10.67,36.83
  Bottom 0.813: v10.67,36.83 v10.67,41.78
  other vias: 14.61,36.2
VCC  (via drill 0.3 pad 0.64, 0.38 pad 0.81)
  Top 0.203: U1*.18 36.46,24.26 35.4,24.26 U1.18 | U1*.6 41.02,28.11 41.02,28.75 U1.6 | U1*.4 41.88,27.56 42.09,27.56 U1.4
  Top 0.305: U5.4 18.79,42.53 v18.8,42.55
  Top 0.406: R4.1 R5.1 R3.1 22.99,8.76 24.77,6.99 28.57,6.99 31.75,10.16 31.75,20.07 28.7,23.11 C4.+ | U1.18 34.03,22.89 C5.2 | R9.2 R10.2 25.27,31.11 25.91,30.48 28.57,30.48 | 29.21,31.11 28.57,30.48 | 29.21,29.84 28.57,30.48 | U1.6 42.63,30.35 C11.2 45.09,29.72 44.58,29.21 43.75,29.21 U1.4
  Top 0.61: 29.21,24.77 31.68,24.77 C5.2 | v49.53,40.64 49.53,34.04 45.85,30.35 C11.2
  Top 0.813: 3V3_VCC_5V.COM2 3V3_VCC_5V.COM1 | v26.67,24.77 C4.+ 29.21,24.77 29.21,29.84 29.21,31.11 v29.21,38.73
  Bottom 0.406: v18.8,42.55 22.61,38.73 v29.21,38.73
  Bottom 0.61: J2.1 59.94,39.12 59.94,33.91 61.85,32 64.52,32 ICSP.6
  Bottom 0.813: 3V3_VCC_5V.COM2 7.37,26.04 25.4,26.04 v26.67,24.77 | J2.1 v49.53,40.64 31.11,40.64 v29.21,38.73
XTAL1
  Top 0.203: U1*.7 40.51,28.31 40.51,29.37 U1.7
  Top 0.406: U1.7 44.8,33.66 C6.2 44.96,36.2 X1.2
XTAL2
  Top 0.203: U1*.8 39.88,28.38 39.88,29.87 U1.8
  Top 0.406: U1.8 42.67,32.66 C8.2 42.67,36.2 X1.1

### Text on the board
tPlace: 1 | 1 | 1 | 1 | 9 | 8 | 7 | 6 | 5 | 4 | 3 | 2 | 1 | 0 | 3 | 2 | 1 | 0 | GND | DIGITAL | TX | RX | AREF | PWM | PWM | PWM | PWM | PWM | PWM | VCC | TX | RX | GND | RTS | DTR | DSR | RI | CTS | DCD | SCL | RX | SDA | TX | 5V | 5V | GND | GND | POWER | ANALOG | ADC | 6 | 7 | RST | 3V3 | 5V | GND | Vin | 0 | 1 | 2 | 3 | 4 | 5
bPlace: Seeeduino | v3.0 11/17/2011 by Albert Miao | www.seeedstudio.com | CC